# Altium schematic sheet TOP.SchDoc
size A4; DrawnBy: YuJian; SheetNumber: 1; SheetTotal: 6
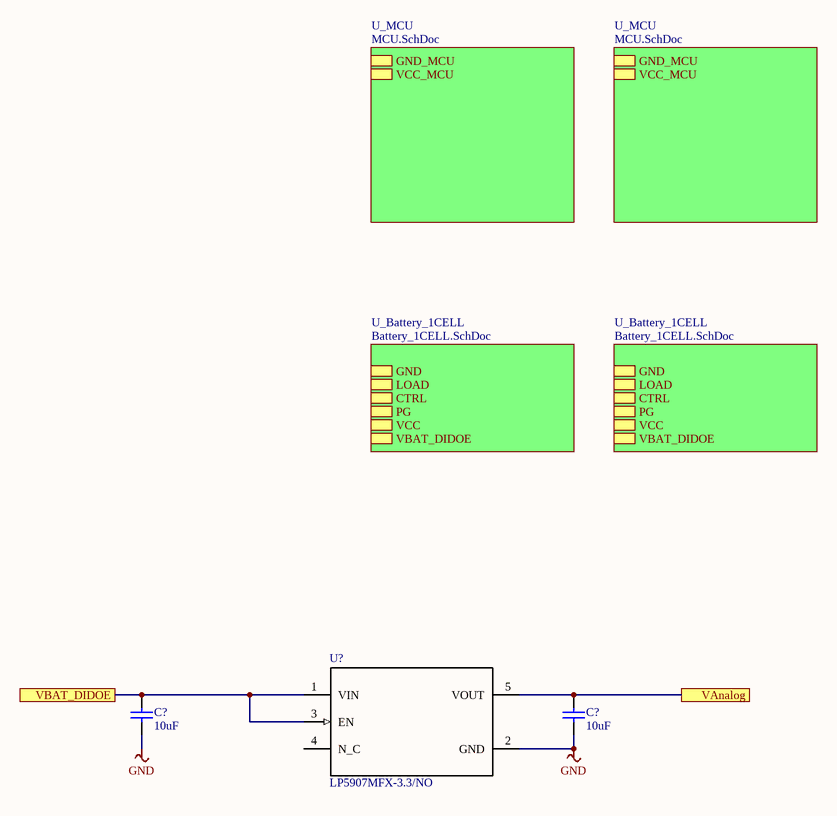
[diagram p0: TOP.SchDoc]

## Parts
(Parts that share a designator on the sheet are numbered #1, #2 ... from top to bottom, then left to right.)
C?#1  10uF  [S0805C]
C?#2  10uF  [S0805C]
U?  LP5907MFX-3.3/NO  [SOT23-5]

## Sub-sheets
U_Battery_1CELL = Battery_1CELL.SchDoc: LOAD, CTRL, PG, VCC, VBAT_DIDOE, GND
U_Battery_1CELL = Battery_1CELL.SchDoc: LOAD, CTRL, PG, VCC, VBAT_DIDOE, GND
U_MCU = MCU.SchDoc: GND_MCU, VCC_MCU
U_MCU = MCU.SchDoc: GND_MCU, VCC_MCU

## Ports
VAnalog, VBAT_DIDOE

## Nets
GND: C?#1.1 C?#2.1 U?.2(GND)
VAnalog: C?#2.2 U?.5(VOUT) ; port VAnalog
VBAT_DIDOE: C?#1.2 U?.1(VIN) U?.3(EN) ; port VBAT_DIDOE

Not connected (* = marked no-connect by the designer): U? 4(N_C)

## Library data of the parts
C?#1 C?#2 = 10uF/0805/16V: 精度 ±10% / 容值 10uF / 额定电压 16V / 温漂系数（介质材料) X7R; Manufacturer: FH(风华); A_Manufacturer: 元六; Code: 0805B106K160NT; CompType: Capacitor; A_Code: J CT41-0805-2R2-16V-106M; A_ComType: 二类电容; Package: 0805; DistributorCode: C92341
U? = LP5907MFX-3.3/NO: 线性稳压器(LDO) / 工作电源电流(Max) 425μA / 最大输入电压 5.5V / 压降(max) 250mV @ 250mA / 输出电压(可调) - / 静态电流(Iq) - / 最大输出电流 250mA / 输出配置 正 / 纹波抑制(PSRR) 90dB ~ 60dB(100Hz ~ 100kHz) / 输出类型 固定 / 输出通道数 1 / 工作温度 -40°C ~ 125°C / 使能脚 - / 输出电压(固定) 3.3V; Manufacturer: TI(德州仪器); Code: LP5907MFX-3.3/NOPB; CompType: LDO; DistributorCode: C80670; Package: SOT-23-5